# EAGLE schematic Group Project PCB Updated (EAGLE 9.6.2)
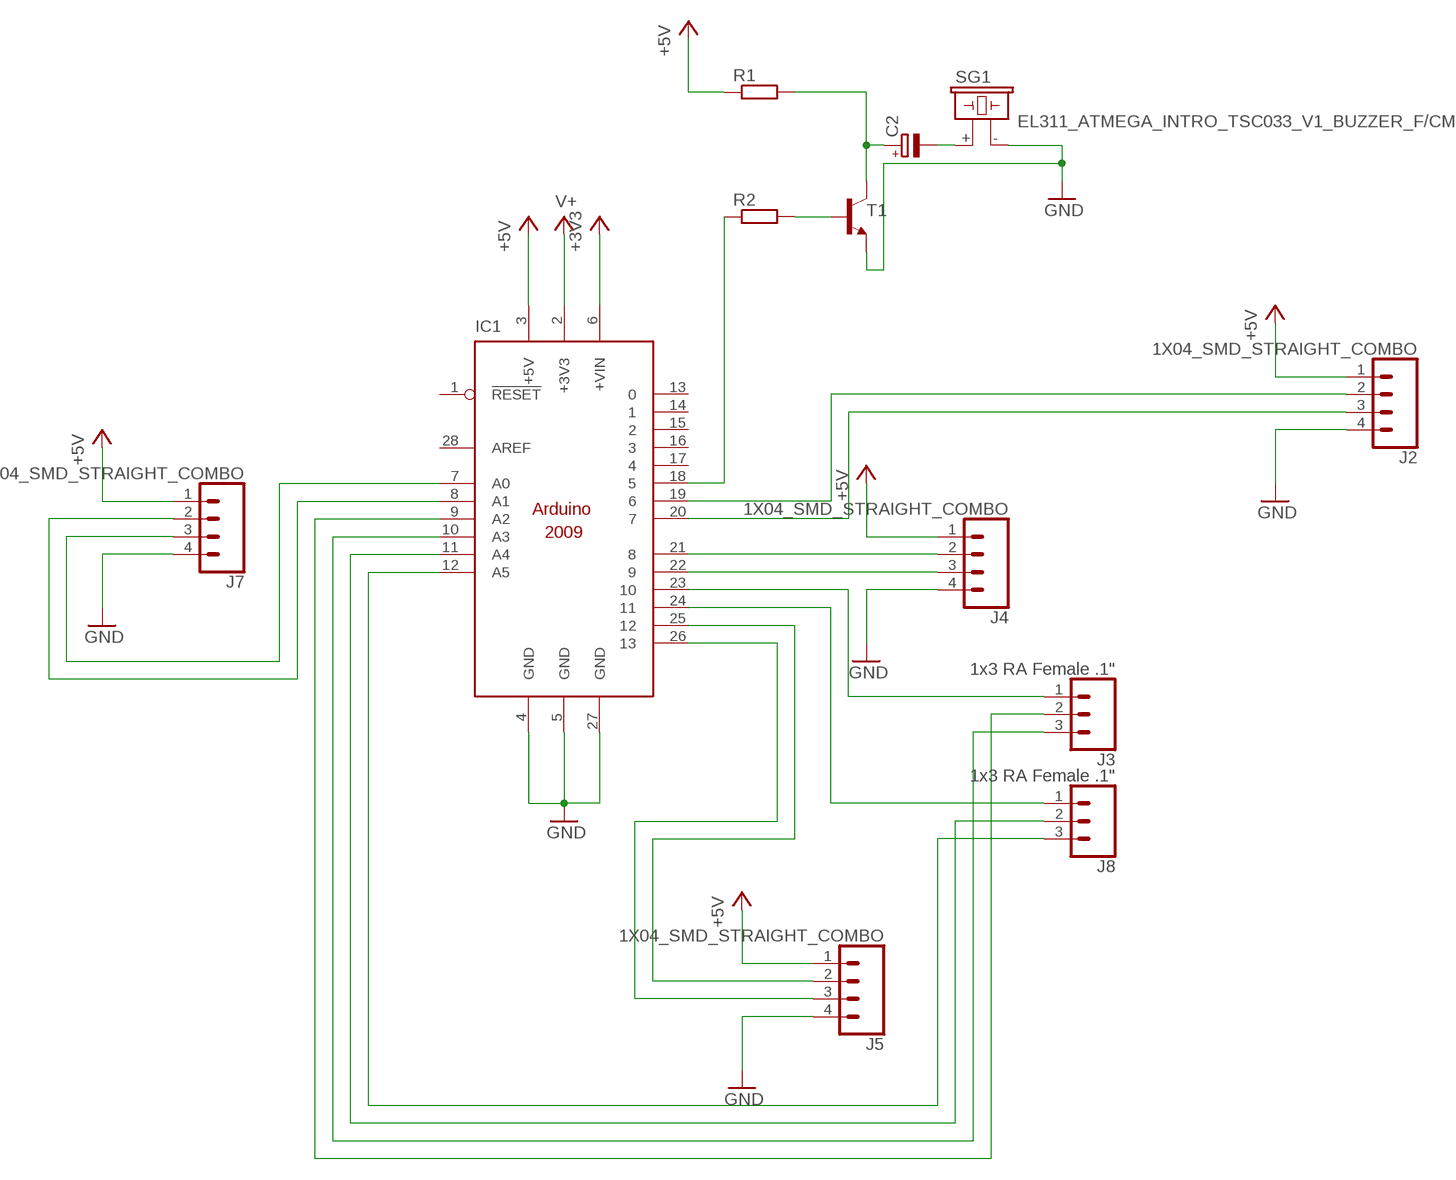
[diagram p0: schematic, sheet 1]

## Parts
C2  RCL_CPOL-EUE3.5-8  [ELECTROLYTIC_CAP_RCL_E3,5-8]
IC1  ARDUINO2009_10  [ARDUINO2009]
J2  1X04_SMD_STRAIGHT_COMBO  CONN_04LONGPADS  [1X04_LONGPADS]
J3  1x3 RA Female .1"  CONN_03LONGPADS  [1X03_LONGPADS]
J4  1X04_SMD_STRAIGHT_COMBO  CONN_04LONGPADS  [1X04_LONGPADS]
J5  1X04_SMD_STRAIGHT_COMBO  CONN_04LONGPADS  [1X04_LONGPADS]
J7  1X04_SMD_STRAIGHT_COMBO  CONN_04LONGPADS  [1X04_LONGPADS]
J8  1x3 RA Female .1"  CONN_03LONGPADS  [1X03_LONGPADS]
R1  R-EU_0207/10  [0207/10]
R2  R-EU_0207/10  [0207/10]
SG1  EL311_ATMEGA_INTRO_TSC033_V1_BUZZER_F/CM12P  [EL311_ATMEGA_INTRO_TSC033_V1_BUZZER_F/CM12P]
T1  2N1613-NPN-TO92-EBC  [TO92-EBC]

## Nets
+3V3: IC1.6(+VIN)
+5V: IC1.3(+5V) J2.1 J4.1 J5.1 J7.1 R1.1
GND: IC1.4(GND) IC1.5(GND) IC1.27(GND) J2.4 J4.4 J5.4 J7.4 SG1.- T1.E
N$1: R2.2 T1.B
N$2: C2.- SG1.+
N$3: IC1.21 J4.2
N$4: IC1.22 J4.3
N$5: IC1.19 J2.2
N$6: IC1.20 J2.3
N$7: IC1.8(A1) J7.2
N$8: IC1.7(A0) J7.3
N$9: IC1.25 J5.2
N$10: IC1.26 J5.3
N$11: C2.+ R1.2 T1.C
N$12: IC1.18 R2.1
N$13: IC1.23 J3.1
N$14: IC1.24 J8.1
N$15: IC1.9(A2) J3.2
N$16: IC1.11(A4) J8.2
N$17: IC1.10(A3) J3.3
N$18: IC1.12(A5) J8.3
V+: IC1.2(+3V3)
Unconnected: IC1.1(!RESET) IC1.13 IC1.14 IC1.15 IC1.16 IC1.17 IC1.28(AREF)

## Library data of the parts
C2 = EENG3110 V1 Library:RCL_CPOL-EU: POLARIZED CAPACITOR, European symbol
IC1 = arduino:ARDUINO2009_1: The Arduino Duemilanove ("2009") is a microcontroller board based on the ATmega168 or ATmega328. - 14 digital input/output pins (of which 6 can be used as PWM outputs) - 6 analog inputs, a 16 MHz crystal oscillator - USB connection - power jack - ISP header - reset button It contains everything needed to support the microcontroller; simply connect it to a computer with a USB cable or power it with a AC-to-DC adapter or battery to get started http://arduino.cc/en/Main/ArduinoBoardDuemilanove
J2 J4 J5 J7 = EENG3110 V1 Library:CONN_04: Multi connection point. Often used as Generic Header-pin footprint for 0.1 inch spaced/style header connections On any of the 0.1 inch spaced packages, you can populate with these: Break Away Headers - Straight <https://www.sparkfun.com/products/116> (PRT-00116) Break Away Male Headers - Right Angle <https://www.sparkfun.com/products/553> (PRT-00553) Female Headers <https://www.sparkfun.com/products/115> (PRT-00115) Break Away Headers - Machine Pin <https://www.sparkfun.com/products/117> (PRT-00117) Break Away Female Headers - Swiss Machine Pin <https://www.sparkfun.com/products/743> (PRT-00743) For SCREWTERMINALS and SPRING TERMINALS visit here: Screw Terimnals on SparkFun.com <https://www.sparkfun.com/search/results?term=Screw+Terminals> (5mm/3.5mm/2.54mm spacing) This device is also useful as a general connection point to wire up your design to another part of your project. Our various solder wires solder well into these plated through hole pads. Hook-Up Wire - Assortment (Stranded, 22 AWG) <https://www.sparkfun.com/products/11375> (PRT-11375) Hook-Up Wire - Assortment (Solid Core, 22 AWG) <https://www.sparkfun.com/products/11367> (PRT-11367) View the entire wire category on our website here <https://www.sparkfun.com/categories/141> Special notes: Molex polarized connector foot print use with SKU : PRT-08231 with associated crimp pins and housings. 1MM SMD Version SKU: PRT-10208; PROD_ID: CONN-08511; SF_ID: PRT-12638
J3 J8 = EENG3110 V1 Library:CONN_03: Multi connection point. Often used as Generic Header-pin footprint for 0.1 inch spaced/style header connections On any of the 0.1 inch spaced packages, you can populate with these: Break Away Headers - Straight <https://www.sparkfun.com/products/116> (PRT-00116) Break Away Male Headers - Right Angle <https://www.sparkfun.com/products/553> (PRT-00553) Female Headers <https://www.sparkfun.com/products/115> (PRT-00115) Break Away Headers - Machine Pin <https://www.sparkfun.com/products/117> (PRT-00117) Break Away Female Headers - Swiss Machine Pin <https://www.sparkfun.com/products/743> (PRT-00743) Stackable Header - 3 Pin (Female, 0.1") <https://www.sparkfun.com/products/13875> (PRT-13875) For SCREWTERMINALS and SPRING TERMINALS visit here: Screw Terimnals on SparkFun.com <https://www.sparkfun.com/search/results?term=Screw+Terminals> (5mm/3.5mm/2.54mm spacing) This device is also useful as a general connection point to wire up your design to another part of your project. Our various solder wires solder well into these plated through hole pads. Hook-Up Wire - Assortment (Stranded, 22 AWG) <https://www.sparkfun.com/products/11375> (PRT-11375) Hook-Up Wire - Assortment (Solid Core, 22 AWG) <https://www.sparkfun.com/products/11367> (PRT-11367) View the entire wire category on our website here <https://www.sparkfun.com/categories/141> Special notes: Molex polarized connector foot print use with SKU : PRT-08232 with associated crimp pins and housings.; PROD_ID: CONN-10925; SF_ID: PRT-08235; SF_SKU: PRT-08433
R1 R2 = EENG3110 V1 Library:R-EU_: RESISTOR, European symbol
SG1 = EENG3110 V1 Library:EL311_ATMEGA_INTRO_TSC033_V1_BUZZER_F/CM12P: BUZZER Source: Buerklin; OC_FARNELL: unknown; OC_NEWARK: unknown
T1 = EENG3110 V1 Library:*-NPN-: NPN Transistror